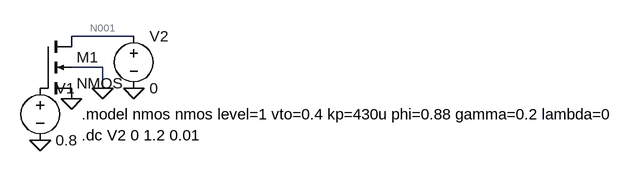
[diagram p0: schematic Lab01.asc]
Lab01.asc, the LTspice schematic file:
Version 4
SHEET 1 976 680
WIRE 144 48 48 48
WIRE 96 96 48 96
WIRE 96 128 96 96
FLAG 96 128 0
FLAG 144 128 0
FLAG 48 144 0
FLAG 0 208 0
SYMBOL nmos4 0 48 R0
SYMATTR InstName M1
SYMATTR Value2 l=0.1u w=1u
SYMBOL voltage 0 112 R0
WINDOW 123 0 0 Left 0
WINDOW 39 0 0 Left 0
SYMATTR InstName V1
SYMATTR Value 0.8
SYMBOL voltage 144 32 R0
WINDOW 123 0 0 Left 0
WINDOW 39 0 0 Left 0
SYMATTR InstName V2
SYMATTR Value 0
TEXT 64 168 Left 2 !.model nmos nmos level=1 vto=0.4 kp=430u phi=0.88 gamma=0.2 lambda=0
TEXT 64 200 Left 2 !.dc V2 0 1.2 0.01

The netlist it stands for:
* Lab01.asc
M1 N001 P001 0 0 NMOS l=0.1u w=1u
V1 P001 0 0.8
V2 N001 0 0
.model NMOS NMOS
.model PMOS PMOS
.lib standard.mos
.model nmos nmos level=1 vto=0.4 kp=430u phi=0.88 gamma=0.2 lambda=0
.dc V2 0 1.2 0.01
.backanno
.end

* Results of the author's LTspice run, read from the files saved beside the schematic
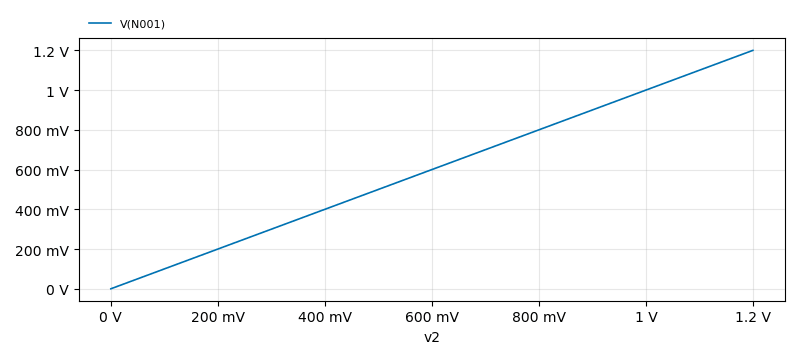
[diagram p1: DC transfer characteristic of Lab01.asc, plotted from the saved traces]
* DC transfer characteristic, 1 run:
*   V(N001): 0 V at v2=0 V, 1.2 V at v2=1.2 V, min 0 V, max 1.2 V